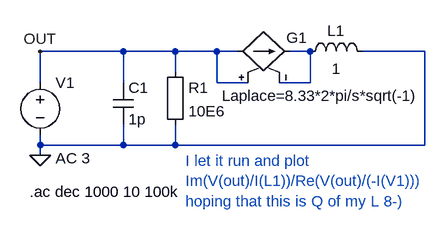
[diagram p0: schematic BfreqDep.asc]
BfreqDep.asc, the LTspice schematic file:
Version 4
SHEET 1 880 680
WIRE -176 240 -176 192
WIRE -176 336 -176 320
WIRE -176 352 -176 336
WIRE -48 192 -176 192
WIRE -48 240 -48 192
WIRE -48 336 -176 336
WIRE -48 336 -48 304
WIRE 32 192 -48 192
WIRE 32 224 32 192
WIRE 32 336 -48 336
WIRE 32 336 32 304
WIRE 96 192 32 192
WIRE 96 240 96 192
WIRE 128 192 96 192
WIRE 144 240 96 240
WIRE 240 192 208 192
WIRE 240 240 192 240
WIRE 240 240 240 192
WIRE 416 192 320 192
WIRE 416 336 32 336
WIRE 416 336 416 192
FLAG -176 352 0
FLAG -176 192 OUT
SYMBOL voltage -176 224 R0
WINDOW 3 24 104 Invisible 0
WINDOW 123 24 132 Left 0
SYMATTR Value SINE(0 3 700)
SYMATTR Value2 AC 3
SYMATTR InstName V1
SYMATTR SpiceLine Rser=0.50 Cpar=1p
SYMBOL ind 224 208 R270
WINDOW 0 32 56 VTop 0
WINDOW 3 5 56 VBottom 0
SYMATTR InstName L1
SYMATTR Value 1
SYMATTR SpiceLine Rser=36.2 Rpar=20E9 Cpar=1p
SYMBOL g2 224 192 M270
WINDOW 0 21 21 VLeft 0
WINDOW 3 -68 120 VLeft 0
SYMATTR InstName G1
SYMATTR Value Laplace=8.33*2*pi/s*sqrt(-1)
SYMBOL Misc\\EuropeanResistor 16 208 R0
SYMATTR InstName R1
SYMATTR Value 10E6
SYMBOL cap -64 240 R0
SYMATTR InstName C1
SYMATTR Value 1p
SYMATTR SpiceLine Rser=100m
TEXT -192 408 Left 0 !.ac dec 1000 10 100k
TEXT 48 360 Left 0 ;I let it run and plot\nIm(V(out)/I(L1))/Re(V(out)/(-I(V1)))\nhoping that this is Q of my L 8-)

The netlist it stands for:
* BfreqDep.asc
V1 OUT 0 SINE(0 3 700) AC 3 Rser=0.50 Cpar=1p
L1 N001 0 1 Rser=36.2 Rpar=20E9 Cpar=1p
G1 OUT N001 OUT N001 Laplace=8.33*2*pi/s*sqrt(-1)
R1 OUT 0 10E6
C1 OUT 0 1p Rser=100m
.ac dec 1000 10 100k
* I let it run and plot
* Im(V(out)/I(L1))/Re(V(out)/(-I(V1)))
* hoping that this is Q of my L 8-)
.backanno
.end